# EAGLE design smoothie ramps (EAGLE 6.2)
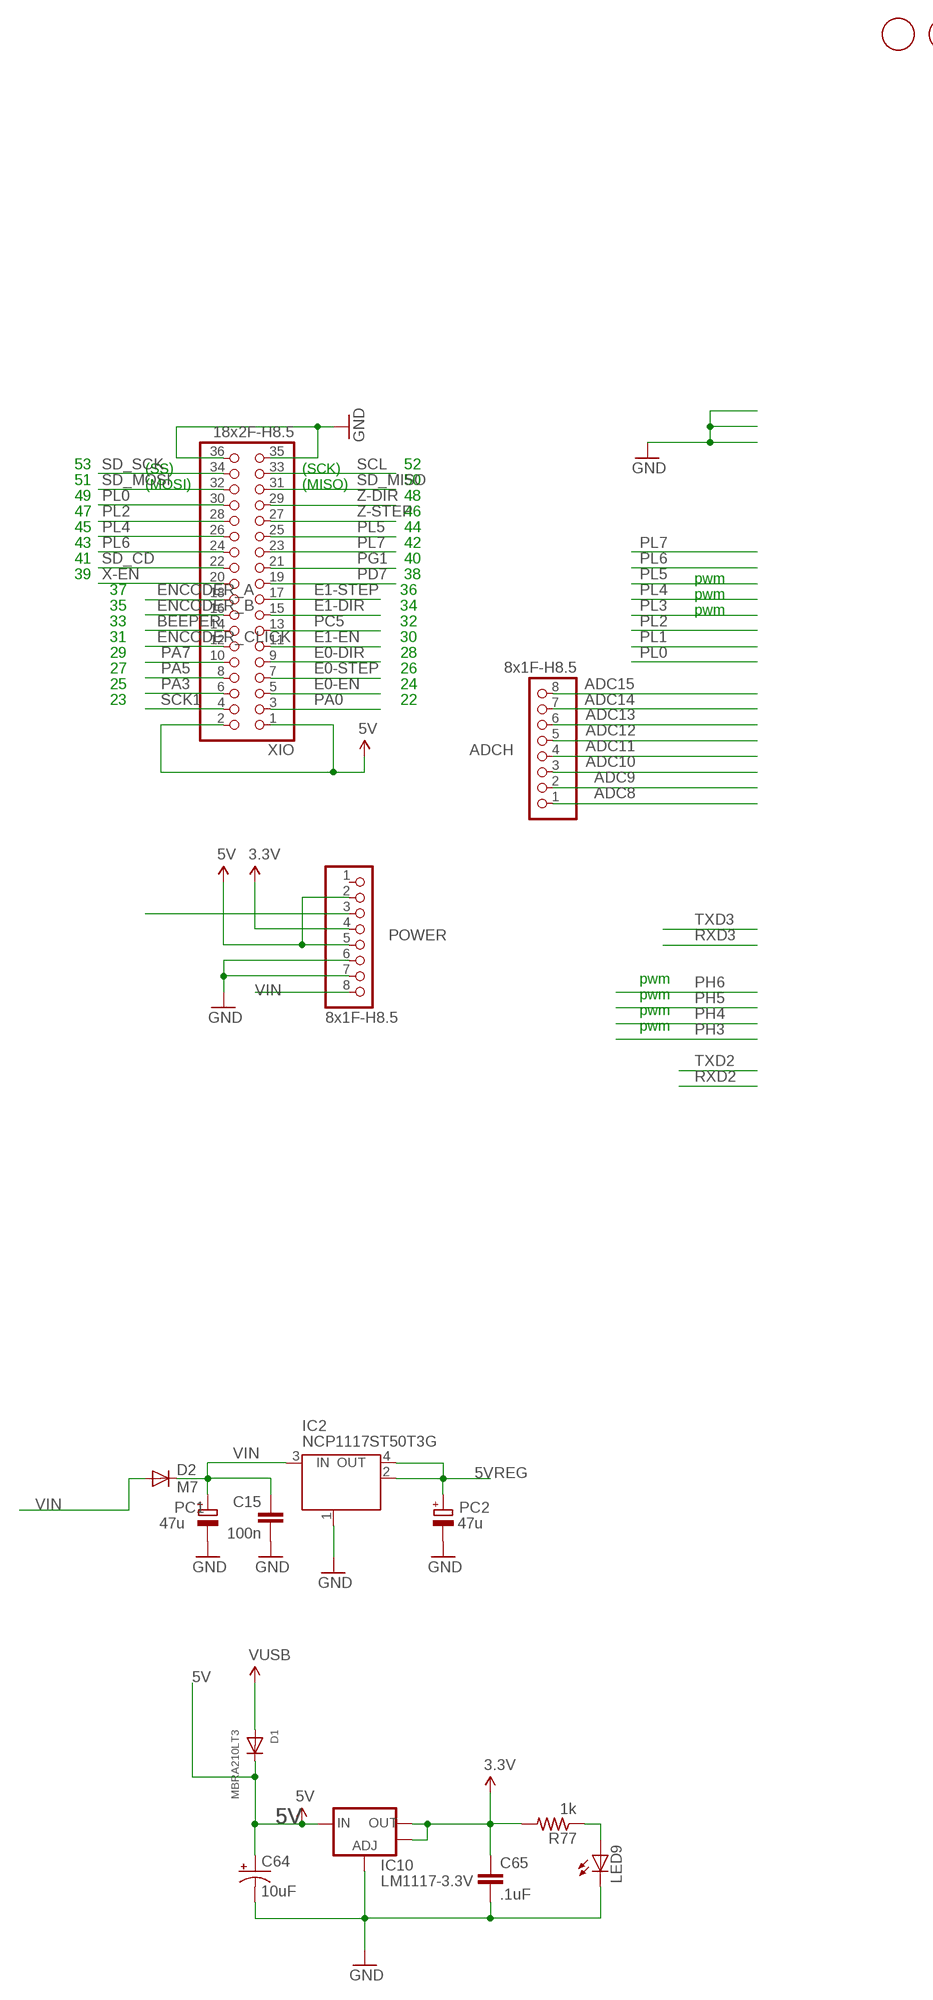
[diagram p0: schematic, sheet 1, part 1 of 2]
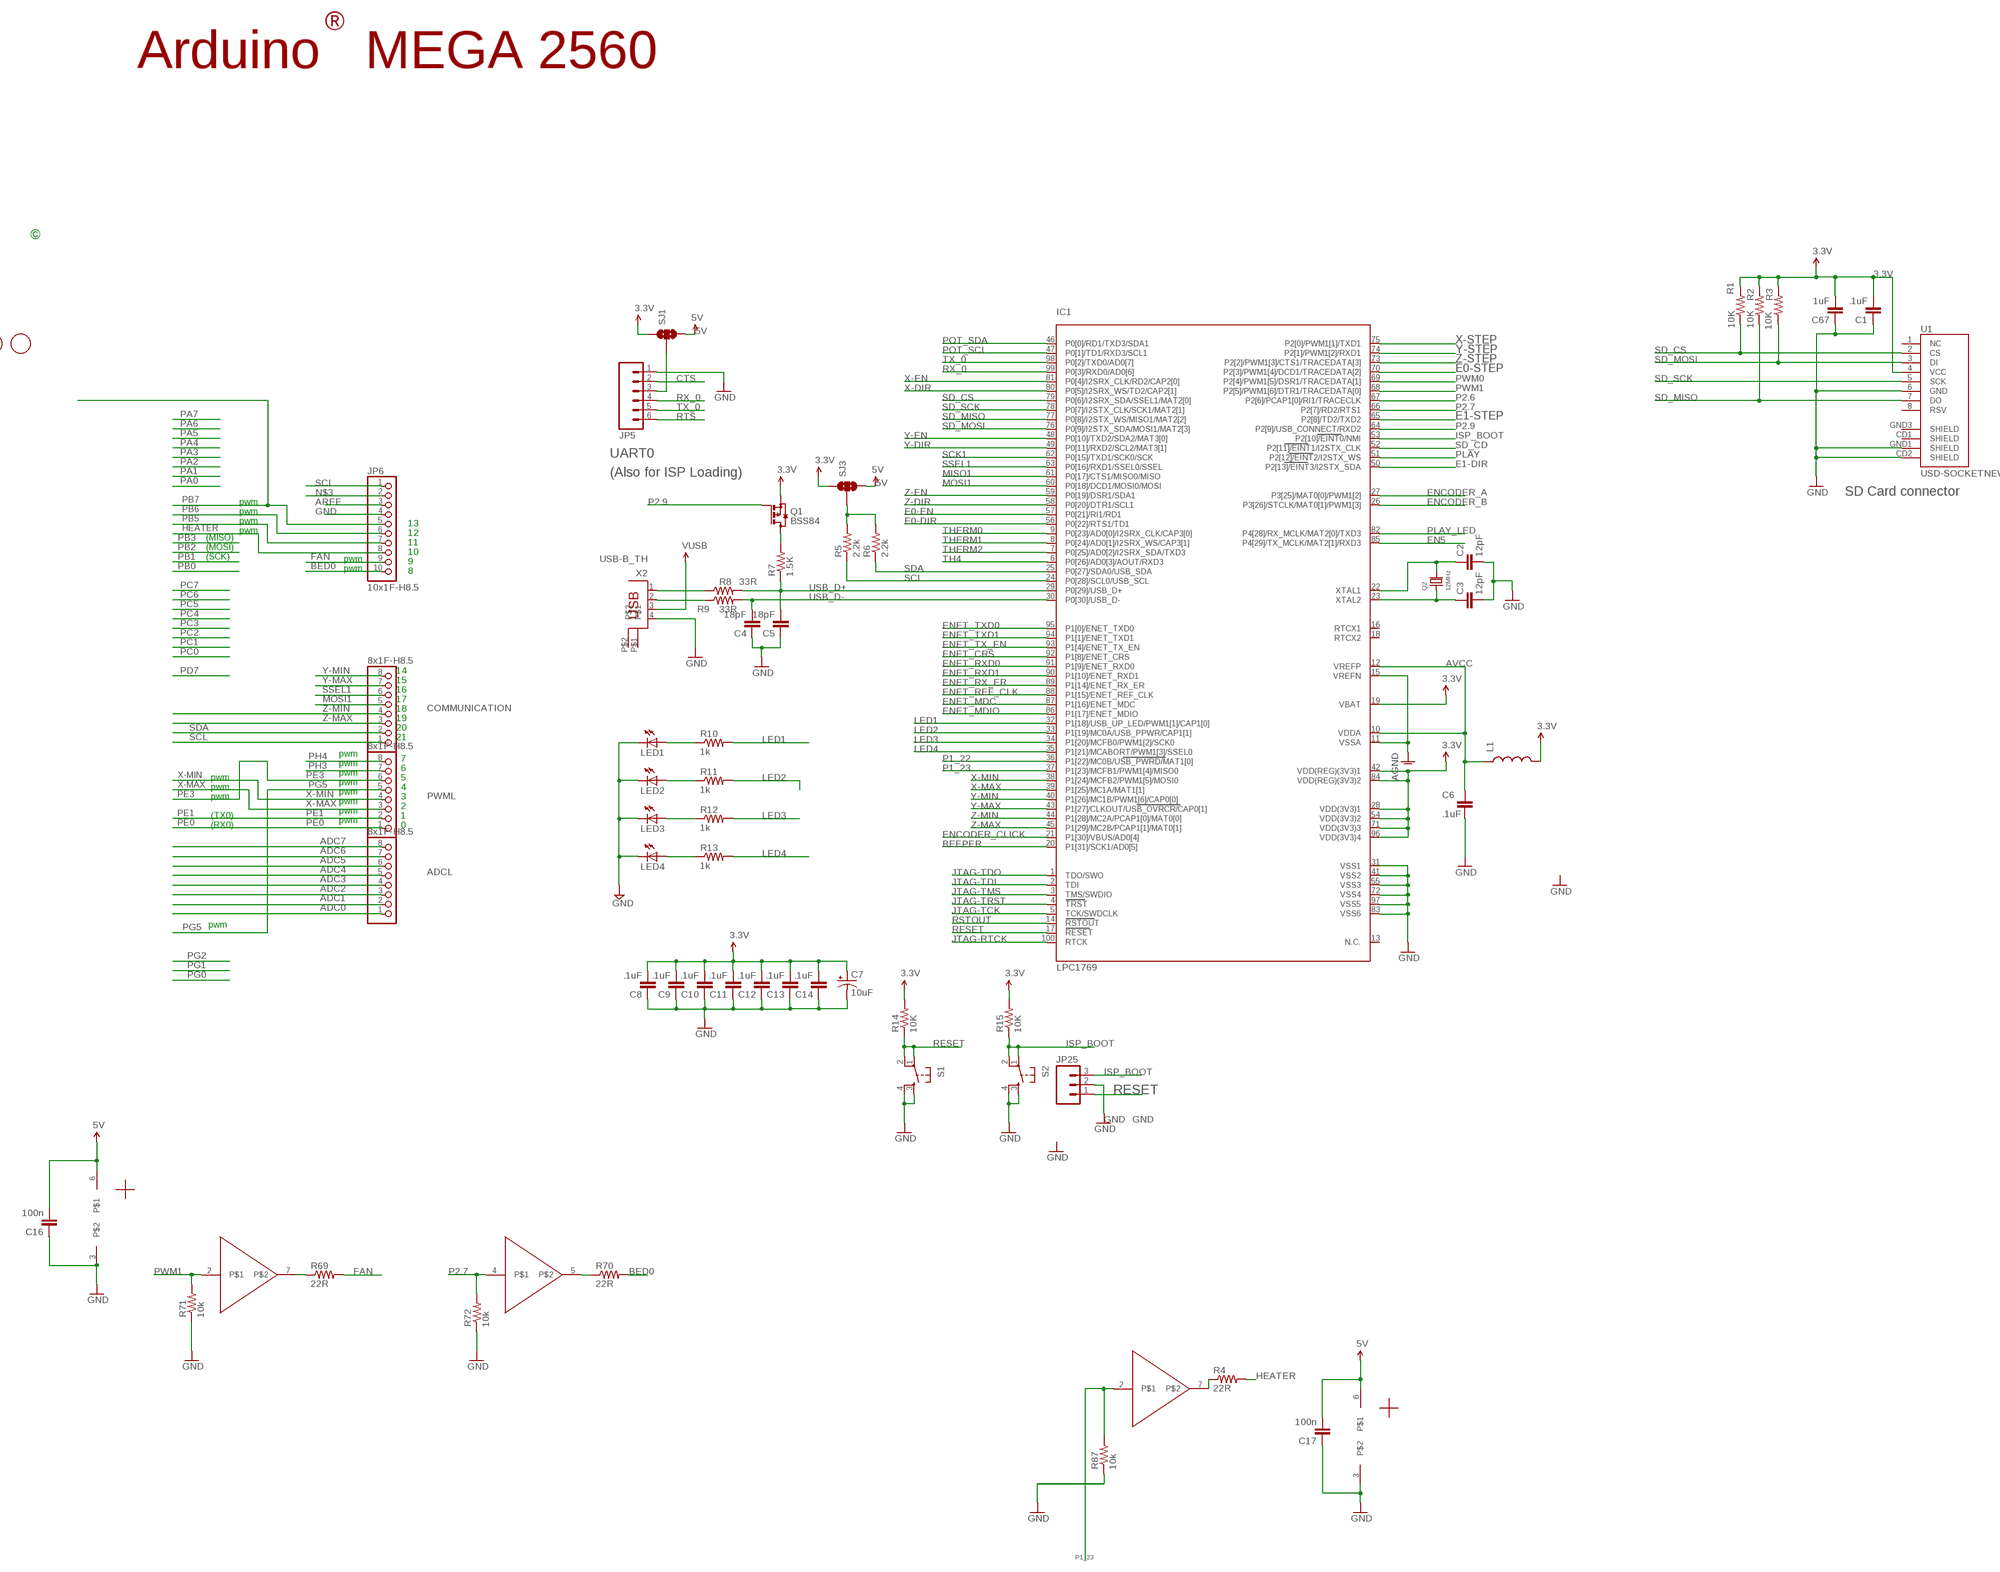
[diagram p1: schematic, sheet 1, part 2 of 2]

## Parts
ADCH  8x1F-H8.5  PINHD-1X8  [1X08]
ADCL  8x1F-H8.5  PINHD-1X8  [1X08]
C1  .1uF  C-EUC0603  [C0603]
C2  12pF  C-EUC0603  [C0603]
C3  12pF  C-EUC0603  [C0603]
C4  18pF  C-EUC0603  [C0603]
C5  18pF  C-EUC0603  [C0603]
C6  .1uF  C-EUC0603  [C0603]
C7  10uF  CAP_POL1206  [EIA3216]
C8  .1uF  C-EUC0603  [C0603]
C9  .1uF  C-EUC0603  [C0603]
C10  .1uF  C-EUC0603  [C0603]
C11  .1uF  C-EUC0603  [C0603]
C12  .1uF  C-EUC0603  [C0603]
C13  .1uF  C-EUC0603  [C0603]
C14  .1uF  C-EUC0603  [C0603]
C15  100n  C-EU0603-RND  [C0603-ROUND]
C16  100n  C-EUC0603  [C0603]
C17  100n  C-EUC0603  [C0603]
C64  10uF  CAP_POL1206  [EIA3216]
C65  .1uF  C-EUC0603  [C0603]
C67  1uF  C-EUC0805  [C0805]
COMMUNICATION  8x1F-H8.5  PINHD-1X8  [1X08]
D1  MBRA210LT3  DIODESMA  [SMADIODE]
D2  M7  DIODE-SMB  [SMB]
FD2  FIDUCIALMOUNT  [FIDUCIA-MOUNT]
FD3  FIDUCIALMOUNT  [FIDUCIA-MOUNT]
IC1  LPC1769  LPC1768  [LQFP100]
IC2  NCP1117ST50T3G  MC33269ST-3.3T3  [SOT223]
IC10  LM1117-3.3V  V_REG_LM1117SOT223  [SOT223]
IC14  TC4427  [SOIC8]
IC15  TC4427  [SOIC8]
JP5  M06POLAR  [MOLEX-1X6]
JP6  10x1F-H8.5  PINHD-1X10_ARD  [1X10]
JP25  M03PTH  [1X03]
L1  INDUCTOR0603  [0603]
LED1  LEDCHIP-LED0805  [CHIP-LED0805]
LED2  LEDCHIP-LED0805  [CHIP-LED0805]
LED3  LEDCHIP-LED0805  [CHIP-LED0805]
LED4  LEDCHIP-LED0805  [CHIP-LED0805]
LED9  LEDCHIP-LED0805  [CHIP-LED0805]
PC1  47u  CPOL-EUD  [PANASONIC_D]
PC2  47u  CPOL-EUD  [PANASONIC_D]
POWER  8x1F-H8.5  PINHD-1X8  [1X08]
PWML  8x1F-H8.5  PINHD-1X8  [1X08]
Q1  BSS84  [SOT23]
Q2  12MHz  CRYSTALTHIN  [CRYSTAL_3.2X2.5]
R1  10K  R-US_R0603  [R0603]
R2  10K  R-US_R0603  [R0603]
R3  10K  R-US_R0603  [R0603]
R4  22R  R-US_R0603  [R0603]
R5  2.2k  R-US_R0603  [R0603]
R6  2.2k  R-US_R0603  [R0603]
R7  1.5K  R-US_R0603  [R0603]
R8  33R  R-US_R0603  [R0603]
R9  33R  R-US_R0603  [R0603]
R10  1k  R-US_R0603  [R0603]
R11  1k  R-US_R0603  [R0603]
R12  1k  R-US_R0603  [R0603]
R13  1k  R-US_R0603  [R0603]
R14  10K  R-US_R0603  [R0603]
R15  10K  R-US_R0603  [R0603]
R69  22R  R-US_R0603  [R0603]
R70  22R  R-US_R0603  [R0603]
R71  10k  R-US_R0603  [R0603]
R72  10k  R-US_R0603  [R0603]
R77  1k  R-US_R0603  [R0603]
R87  10k  R-US_R0603  [R0603]
S1  TAC_SWITCHSMD  [TACTILE_SWITCH_SMD]
S2  TAC_SWITCHSMD  [TACTILE_SWITCH_SMD]
SJ1  SOLDERJUMPER_2WAYS  [SJ_3]
SJ3  SOLDERJUMPER_2WAYS  [SJ_3]
U1  USD-SOCKETNEW  [MICRO-SD-SOCKET-PP]
X2  USB-B_TH  PN61729  [PN61729]
XIO  18x2F-H8.5  PINHD-2X18  [2X18]

## Nets
3.3V: C1.2 C7.A(+) C8.2 C9.2 C10.2 C11.2 C12.2 C13.2 C14.2 C65.1 C67.2 IC1.19(VBAT) IC1.28(VDD(3V3)1) IC1.42(VDD(REG)(3V3)1) IC1.54(VDD(3V3)2) IC1.71(VDD(3V3)3) IC1.84(VDD(REG)(3V3)2) IC1.96(VDD(3V3)4) IC10.2(OUT) IC10.4(OUT) L1.2 POWER.4 Q1.2(S) R1.2 R2.2 R3.2 R14.2 R15.2 R77.2 SJ1.1 SJ3.1 U1.4(VCC)
5V: C16.2 C17.2 C64.A(+) D1.C IC10.3(IN) IC14.6 IC15.6 POWER.2 POWER.5 SJ1.3 SJ3.3 XIO.1 XIO.2
5VREG: IC2.2(OUT) IC2.4(OUT) PC2.+
ADC0: ADCL.1
ADC1: ADCL.2
ADC2: ADCL.3
ADC3: ADCL.4
ADC4: ADCL.5
ADC5: ADCL.6
ADC6: ADCL.7
ADC7: ADCL.8
ADC8: ADCH.1
ADC9: ADCH.2
ADC10: ADCH.3
ADC11: ADCH.4
ADC12: ADCH.5
ADC13: ADCH.6
ADC14: ADCH.7
ADC15: ADCH.8
AGND: IC1.11(VSSA) IC1.15(VREFN)
AREF: JP6.3
AVCC: C6.1 IC1.10(VDDA) IC1.12(VREFP) L1.1
BED0: JP6.10 R70.2
BEEPER: IC1.20(P1[31]/SCK1/AD0[5]) XIO.14
CTS: JP5.2
E0-DIR: IC1.56(P0[22]/RTS1/TD1) XIO.9
E0-EN: IC1.57(P0[21]/RI1/RD1) XIO.5
E0-STEP: IC1.70(P2[3]/PWM1[4]/DCD1/TRACEDATA[2]) XIO.7
E1-DIR: IC1.50(P2[13]/EINT3/I2STX_SDA) XIO.15
E1-EN: XIO.11
E1-STEP: IC1.65(P2[8]/TD2/TXD2) XIO.17
EN5: IC1.85(P4[29]/TX_MCLK/MAT2[1]/RXD3)
ENCODER_A: IC1.27(P3[25]/MAT0[0]/PWM1[2]) XIO.18
ENCODER_B: IC1.26(P3[26]/STCLK/MAT0[1]/PWM1[3]) XIO.16
ENCODER_CLICK: IC1.21(P1[30]/VBUS/AD0[4]) XIO.12
ENET_CRS: IC1.92(P1[8]/ENET_CRS)
ENET_MDC: IC1.87(P1[16]/ENET_MDC)
ENET_MDIO: IC1.86(P1[17]/ENET_MDIO)
ENET_REF_CLK: IC1.88(P1[15]/ENET_REF_CLK)
ENET_RX_ER: IC1.89(P1[14]/ENET_RX_ER)
ENET_RXD0: IC1.91(P1[9]/ENET_RXD0)
ENET_RXD1: IC1.90(P1[10]/ENET_RXD1)
ENET_TX_EN: IC1.93(P1[4]/ENET_TX_EN)
ENET_TXD0: IC1.95(P1[0]/ENET_TXD0)
ENET_TXD1: IC1.94(P1[1]/ENET_TXD1)
FAN: JP6.9 R69.2
GND [gnd]: C1.1 C2.2 C3.2 C4.1 C5.1 C6.2 C7.C(-) C8.1 C9.1 C10.1 C11.1 C12.1 C13.1 C14.1 C15.2 C16.1 C17.1 C64.C(-) C65.2 C67.1 IC1.31(VSS1) IC1.41(VSS2) IC1.55(VSS3) IC1.72(VSS4) IC1.83(VSS6) IC1.97(VSS5) IC2.1(GND/ADJ) IC10.1(ADJ) IC14.3 IC15.3 JP5.1 JP6.4 JP25.2 LED1.C LED2.C LED3.C LED4.C LED9.C PC1.- PC2.- POWER.6 POWER.7 R71.1 R72.1 R87.1 S1.3 S1.4 S2.3 S2.4 U1.6(GND) U1.CD2(SHIELD) U1.GND1(SHIELD) X2.4 XIO.35 XIO.36
HEATER: JP6.8 R4.2
ISP_BOOT: IC1.53(P2[10]/EINT0/NMI) JP25.3 R15.1 S2.1 S2.2
JTAG-RTCK: IC1.100(RTCK)
JTAG-TCK: IC1.5(TCK/SWDCLK)
JTAG-TDI: IC1.2(TDI)
JTAG-TDO: IC1.1(TDO/SWO)
JTAG-TMS: IC1.3(TMS/SWDIO)
JTAG-TRST: IC1.4(TRST)
LED1: IC1.32(P1[18]/USB_UP_LED/PWM1[1]/CAP1[0]) R10.2
LED2: IC1.33(P1[19]/MC0A/USB_PPWR/CAP1[1]) R11.2
LED3: IC1.34(P1[20]/MCFB0/PWM1[2]/SCK0) R12.2
LED4: IC1.35(P1[21]/MCABORT/PWM1[3]/SSEL0) R13.2
MISO1: IC1.61(P0[17]/CTS1/MISO0/MISO)
MOSI1: COMMUNICATION.5 IC1.60(P0[18]/DCD1/MOSI0/MOSI)
N$1: C2.1 IC1.22(XTAL1) Q2.2
N$2: C3.1 IC1.23(XTAL2) Q2.1
N$3: JP6.2
N$4: IC15.7 R4.1
N$5: IC14.7 R69.1
N$19: IC14.5 R70.1
N$23: JP5.3 SJ1.2
N$51: Q1.3(D) R7.2
N$61: R8.1 X2.1
N$62: R9.1 X2.2
N$80: LED9.A R77.1
N$84: LED4.A R13.1
N$85: LED3.A R12.1
N$86: LED2.A R11.1
N$87: LED1.A R10.1
N$124: R5.2 R6.2 SJ3.2
P1_22: IC1.36(P1[22]/MC0B/USB_PWRD/MAT1[0])
P1_23: IC1.37(P1[23]/MCFB1/PWM1[4]/MISO0) IC15.2 R87.2
P2.6: IC1.67(P2[6]/PCAP1[0]/RI1/TRACECLK)
P2.7: IC1.66(P2[7]/RD2/RTS1) IC14.4 R72.2
P2.9: IC1.64(P2[9]/USB_CONNECT/RXD2) Q1.1(G)
PA0: XIO.3
PA3: XIO.6
PA5: XIO.8
PA7: XIO.10
PB5: JP6.7
PB6: JP6.6
PB7: JP6.5
PC5: XIO.13
PD7: XIO.19
PE0: PWML.1
PE1: PWML.2
PE3: PWML.6
PG1: XIO.21
PG5: PWML.5
PH3: PWML.7
PH4: PWML.8
PL0: XIO.30
PL2: XIO.28
PL4: XIO.26
PL5: XIO.25
PL6: XIO.24
PL7: XIO.23
PLAY: IC1.51(P2[12]/EINT2/I2STX_WS)
PLAY_LED: IC1.82(P4[28]/RX_MCLK/MAT2[0]/TXD3)
POT_SCL: IC1.47(P0[1]/TD1/RXD3/SCL1)
POT_SDA: IC1.46(P0[0]/RD1/TXD3/SDA1)
PWM0: IC1.69(P2[4]/PWM1[5]/DSR1/TRACEDATA[1])
PWM1: IC1.68(P2[5]/PWM1[6]/DTR1/TRACEDATA[0]) IC14.2 R71.2
RESET: IC1.17(RESET) JP25.1 POWER.3 R14.1 S1.1 S1.2
RSTOUT: IC1.14(RSTOUT)
RTS: JP5.6
RX_0: IC1.99(P0[3]/RXD0/AD0[6]) JP5.4
SCK1: IC1.62(P0[15]/TXD1/SCK0/SCK) XIO.4
SCL: COMMUNICATION.1 IC1.24(P0[28]/SCL0/USB_SCL) JP6.1 R5.1 XIO.33
SD_CD: IC1.52(P2[11]/EINT1/I2STX_CLK) XIO.22
SD_CS: IC1.79(P0[6]/I2SRX_SDA/SSEL1/MAT2[0]) R1.1 U1.2(CS)
SD_MISO: IC1.77(P0[8]/I2STX_WS/MISO1/MAT2[2]) R2.1 U1.7(DO) XIO.31
SD_MOSI: IC1.76(P0[9]/I2STX_SDA/MOSI1/MAT2[3]) R3.1 U1.3(DI) XIO.32
SD_SCK: IC1.78(P0[7]/I2STX_CLK/SCK1/MAT2[1]) U1.5(SCK) XIO.34
SDA: COMMUNICATION.2 IC1.25(P0[27]/SDA0/USB_SDA) R6.1
SSEL1: COMMUNICATION.6 IC1.63(P0[16]/RXD1/SSEL0/SSEL)
TH4: IC1.6(P0[26]/AD0[3]/AOUT/RXD3)
THERM0: IC1.9(P0[23]/AD0[0]/I2SRX_CLK/CAP3[0])
THERM1: IC1.8(P0[24]/AD0[1]/I2SRX_WS/CAP3[1])
THERM2: IC1.7(P0[25]/AD0[2]/I2SRX_SDA/TXD3)
TX_0: IC1.98(P0[2]/TXD0/AD0[7]) JP5.5
USB_D+: C5.2 IC1.29(P0[29]/USB_D+) R7.1 R8.2
USB_D-: C4.2 IC1.30(P0[30]/USB_D-) R9.2
VIN [power]: C15.1 D2.A D2.C IC2.3(IN) PC1.+ POWER.8
VUSB: D1.A X2.3
X-DIR: IC1.80(P0[5]/I2SRX_WS/TD2/CAP2[1])
X-EN: IC1.81(P0[4]/I2SRX_CLK/RD2/CAP2[0]) XIO.20
X-MAX: IC1.39(P1[25]/MC1A/MAT1[1]) PWML.3
X-MIN: IC1.38(P1[24]/MCFB2/PWM1[5]/MOSI0) PWML.4
X-STEP: IC1.75(P2[0]/PWM1[1]/TXD1)
Y-DIR: IC1.49(P0[11]/RXD2/SCL2/MAT3[1])
Y-EN: IC1.48(P0[10]/TXD2/SDA2/MAT3[0])
Y-MAX: COMMUNICATION.7 IC1.43(P1[27]/CLKOUT/USB_OVRCR/CAP0[1])
Y-MIN: COMMUNICATION.8 IC1.40(P1[26]/MC1B/PWM1[6]/CAP0[0])
Y-STEP: IC1.74(P2[1]/PWM1[2]/RXD1)
Z-DIR: IC1.58(P0[20]/DTR1/SCL1) XIO.29
Z-EN: IC1.59(P0[19]/DSR1/SDA1)
Z-MAX: COMMUNICATION.3 IC1.45(P1[29]/MC2B/PCAP1[1]/MAT0[1])
Z-MIN: COMMUNICATION.4 IC1.44(P1[28]/MC2A/PCAP1[0]/MAT0[0])
Z-STEP: IC1.73(P2[2]/PWM1[3]/CTS1/TRACEDATA[3]) XIO.27
Unconnected: IC1.13(N.C.) IC1.16(RTCX1) IC1.18(RTCX2) IC15.4 IC15.5 POWER.1 U1.1(NC) U1.8(RSV) U1.CD1(SHIELD) U1.GND3(SHIELD) X2.P$1 X2.P$2

## Notes on the sheet
- ®
- Arduino   MEGA 2560
- ©
- UART0
- (Also for ISP Loading)
- SD Card connector
- pwm
- pwm
- pwm | 13
- pwm | 12
- (MISO)
- 11
- (MOSI)
- 10
- (SCK) | pwm
- 9
- pwm | 8
- 53 | (SS) | (SCK) | 52
- 51 | (MOSI) | (MISO) | 50
- 49 | 48
- 47 | 46
- 45 | 44
- 43 | 42
- 41 | 40
- 39 | 38 | pwm | 14
- 37 | 36 | pwm | 15
- 35 | 34 | pwm | 16
- 33 | 32 | 17
- 31 | 30 | 18
- 29 | 28 | 19
- 27 | 26 | 20
- 25 | 24 | 21
- 23 | 22
- pwm
- 7
- pwm
- 6
- pwm
- pwm | 5
- pwm
- pwm | 4
- pwm
- pwm | 3
- pwm
- 2
- pwm
- (TX0) | 1
- pwm
- (RX0) | 0
- pwm
- pwm | pwm
- pwm
- pwm
- MEGA Conn.

## Library data of the parts
ADCH ADCL COMMUNICATION POWER PWML = SmartPrj:PINHD-1X8: PIN HEADER
C1 C65 C67 = resistor:C-EU: CAPACITOR, European symbol
C2-C6 C8-C14 C16 C17 = rcl:C-EU: CAPACITOR, European symbol
C7 C64 = SparkFun:CAP_POL: Capacitor Polarized These are standard SMD and PTH capacitors. Normally 10uF, 47uF, and 100uF in electrolytic and tantalum varieties. Always verify the external diameter of the through hole cap, it varies with capacity, voltage, and manufacturer. The EIA devices should be standard.
C15 = SmartPrj:C-EU: CAPACITOR, European symbol
D1 = microbuilder:DIODE: Diode SMADIODE - SMA Surface Mount Package 20V 1A Schottky Diode Digikey (500mV @ 1A, 500uA Vr @ 20V): 641-1014-6-ND 10V 2A Schottky Diode Digikey (350mV @ 2A, 700uA Vr @ 10V): MBRA210LT3 SOD-123 30V 200mA (800mV Vf, 2uA Vr @ 25V) Schottky Diode (very fast switching for boost, etc.) - Digikey: BAT54T1GOSTR-ND 30V 500mA (430mV Vf, 130uA Vr @ 30V) Schottky Diode - Digikey: B0530W-FDICT-ND MBR120 1A 20V (0.34Vf) Schottky Diode - Digikey: MBR120VLSFT1GOSCT-ND SOD-323 10V 570mA (380mV Vf, 3ns) Schottky Diode - Digikey: ZLLS410CT-ND 1N4148WS - 75V 150mA (1V Vf @ 10mA, 4ns) Simple Diode - Digikey: 1N4148WSFSCT-ND, Mouser: 512-1N4148WS SOD-523 BAT54 30V 200mA Schottky (0.8 Vf @ 100mA, 5ns) - Digikey: BAT54XV2CT-ND 30V 30mA Schottky Diode (RB751S-40TE61) - Digikey: RB751S-40TE61CT-ND SOT23-R/W - SOT23 Package (R = Solder Paste/Reflow Ovens, W = Hand-Soldering) BAT54Film 40V 300mA - Digikey: 497-7162-1-ND DO-1N4148 Through Hole Small Current Diode (any model)
D2 = diode:DIODE-: DIODE
FD2 FD3 = SmartPrj:FIDUCIALMOUNT
IC1 = microbuilder:LPC1768: LPC1768 100 MHz 32-bit ARM Cortex-M3 based microcontroller featuring a high level of integration and low power consumption. 512 kB Flash, 64 kB SRAM, USB Device/Host/OTG, Ethernet, CAN, I2S, 10-bit DAC Digikey: 568-4796-ND
IC2 = linear:MC33269ST*: Adjustable Output Low Dropout Voltage Regulator 800 mA Source: http://www.onsemi.com/pub/Collateral/MC33269-D.PDF
IC10 = SparkFun:V_REG_LM1117: Voltage Regulator LM1117 Standard adjustable voltage regulator but in SMD form. Spark Fun Electronics SKU : COM-00595
IC14 IC15 = custom_esorensen:TC4427
JP5 = SparkFun:M06: Header 6 Standard 6-pin 0.1" header. Use with straight break away headers (SKU : PRT-00116), right angle break away headers (PRT-00553), swiss pins (PRT-00743), machine pins (PRT-00117), and female headers (PRT-00115). Molex polarized connector foot print use with SKU : PRT-08094 with associated crimp pins and housings. NOTES ON THE VARIANTS LOCK and LOCK_LONGPADS... This footprint was designed to help hold the alignment of a through-hole component (i.e. 6-pin header) while soldering it into place. You may notice that each hole has been shifted either up or down by 0.005 of an inch from it's more standard position (which is a perfectly straight line). This slight alteration caused the pins (the squares in the middle) to touch the edges of the holes. Because they are alternating, it causes a "brace" to hold the component in place. 0.005 has proven to be the perfect amount of "off-center" position when using our standard breakaway headers. Although looks a little odd when you look at the bare footprint, once you have a header in there, the alteration is very hard to notice. Also, if you push a header all the way into place, it is covered up entirely on the bottom side. This idea of altering the position of holes to aid alignment will be further integrated into the Sparkfun Library for other footprints. It can help hold any component with 3 or more connection pins.
JP6 = SmartPrj:PINHD-1X10_ARD: PIN HEADER
JP25 = SparkFun-Connectors:M03: Header 3 Standard 3-pin 0.1" header. Use with straight break away headers (SKU : PRT-00116), right angle break away headers (PRT-00553), swiss pins (PRT-00743), machine pins (PRT-00117), and female headers (PRT-00115). Molex polarized connector foot print use with SKU : PRT-08232 with associated crimp pins and housings.
L1 = SparkFun:INDUCTOR: Inductors Basic Inductor/Choke - 0603 and 1206. Footprints are not proven and vary greatly between part numbers.
LED1-LED4 LED9 = led:LED: LED OSRAM: - CHIPLED LG R971, LG N971, LY N971, LG Q971, LY Q971, LO R971, LY R971 LH N974, LH R974 LS Q976, LO Q976, LY Q976 LO Q996 - Hyper CHIPLED LW Q18S LB Q993, LB Q99A, LB R99A - SideLED LS A670, LO A670, LY A670, LG A670, LP A670 LB A673, LV A673, LT A673, LW A673 LH A674 LY A675 LS A676, LA A676, LO A676, LY A676, LW A676 LS A679, LY A679, LG A679 - Hyper Micro SIDELED® LS Y876, LA Y876, LO Y876, LY Y876 LT Y87S - SmartLED LW L88C, LW L88S LB L89C, LB L89S, LG L890 LS L89K, LO L89K, LY L89K LS L896, LA L896, LO L896, LY L896 - TOPLED LS T670, LO T670, LY T670, LG T670, LP T670 LSG T670, LSP T670, LSY T670, LOP T670, LYG T670 LG T671, LOG T671, LSG T671 LB T673, LV T673, LT T673, LW T673 LH T674 LS T676, LA T676, LO T676, LY T676, LB T676, LH T676, LSB T676, LW T676 LB T67C, LV T67C, LT T67C, LS T67K, LO T67K, LY T67K, LW E67C LS E67B, LA E67B, LO E67B, LY E67B, LB E67C, LV E67C, LT E67C LW T67C LS T679, LY T679, LG T679 LS T770, LO T770, LY T770, LG T770, LP T770 LB T773, LV T773, LT T773, LW T773 LH T774 LS E675, LA E675, LY E675, LS T675 LS T776, LA T776, LO T776, LY T776, LB T776 LHGB T686 LT T68C, LB T68C - Hyper Mini TOPLED® LB M676 - Mini TOPLED Santana® LG M470 LS M47K, LO M47K, LY M47K Source: http://www.osram.convergy.de LUXEON: - LUMILED® LXK2-PW12-R00, LXK2-PW12-S00, LXK2-PW14-U00, LXK2-PW14-V00 LXK2-PM12-R00, LXK2-PM12-S00, LXK2-PM14-U00 LXK2-PE12-Q00, LXK2-PE12-R00, LXK2-PE12-S00, LXK2-PE14-T00, LXK2-PE14-U00 LXK2-PB12-K00, LXK2-PB12-L00, LXK2-PB12-M00, LXK2-PB14-N00, LXK2-PB14-P00, LXK2-PB14-Q00 LXK2-PR12-L00, LXK2-PR12-M00, LXK2-PR14-Q00, LXK2-PR14-R00 LXK2-PD12-Q00, LXK2-PD12-R00, LXK2-PD12-S00 LXK2-PH12-R00, LXK2-PH12-S00 LXK2-PL12-P00, LXK2-PL12-Q00, LXK2-PL12-R00 Source: www.luxeon.com KINGBRIGHT: KA-3528ASYC Source: www.kingbright.com
PC1 PC2 = rcl:CPOL-EU: POLARIZED CAPACITOR, European symbol
Q1 = transistor-small-signal:BSS84: P-CHANNEL MOS FET
Q2 = microbuilder:CRYSTAL: Crystals HC49UP - Surface Mount Crystal 4.0MHz 18pF +/-30ppm Surface Mount Crystal [Digikey: 535-9857-1-ND] 12.0 MHz Surface Mount Crystal [Digikey: 535-9869-6-ND] 25.0 MHz Surface Mount Crystal [Digikey: 535-9078-1-ND] 3.2 x 2.5mm - MEMs SMT Crystal 12.0 MHz 8pF 15ppm 3.2 x 2.5mm Crystal [Digikey: -10-70°C: 644-1047-1-ND -40-125°C: 644-1128-1-ND] 16.0 MHz 8pF 15ppm 3.2 x 2.5mm Crystal [Digikey: -10-70°C: 644-1049-1-ND -40-125°C: 644-1129-2-ND] 16.0 MHz 10pF 10ppm 3.2 x 2.5mm Crystal [Digikey: 644-1100-1-ND] 27.12 MHz 18pF 30ppm 3.2 x 2.5mm Crystal [Digikey: 887-1424-1-ND] 27.12MHz 10pF 10ppm 3.2 x 2.5mm Crystal [Digikey: 887-1329-1-ND] 4.9 x 1.8mm - MEMs SMT Crystal 32.768 KHz 12.5pF 20ppm 4.9 x 1.8mm Crystal [Digikey: SE2415CT-ND] Cylinder 32.768KHz Cylinder Crystal
R1-R15 R69-R72 R77 R87 = resistor:R-US_: RESISTOR, American symbol
S1 S2 = SparkFun:TAC_SWITCH: Momentary Switch Button commonly used for reset or general input. Spark Fun Electronics SKU : COM-00097
SJ1 SJ3 = SparkFun:SOLDERJUMPER_2WAY: Solder Jumper 2 way solder jumper
U1 = SparkFun:USD-SOCKET: microSD Socket Push-push type uSD socket. Schematic element and footprint production proven. Spark Fun Electronics SKU : PRT-00127. tDoc lines correctly indicate media card edge positions when inserting (unlocked, locked, depressed).
X2 = SmartPrj:PN61729: BERG USB connector
XIO = SmartPrj:PINHD-2X18: PIN HEADER

## Net classes
1 power: width 0.61 mm, drill 0.406 mm, clearance 0.203 mm
2 gnd: width 0.305 mm, drill 0.406 mm, clearance 0.203 mm
3 power usb: width 0.508 mm, drill 0.406 mm, clearance 0.203 mm

## Board
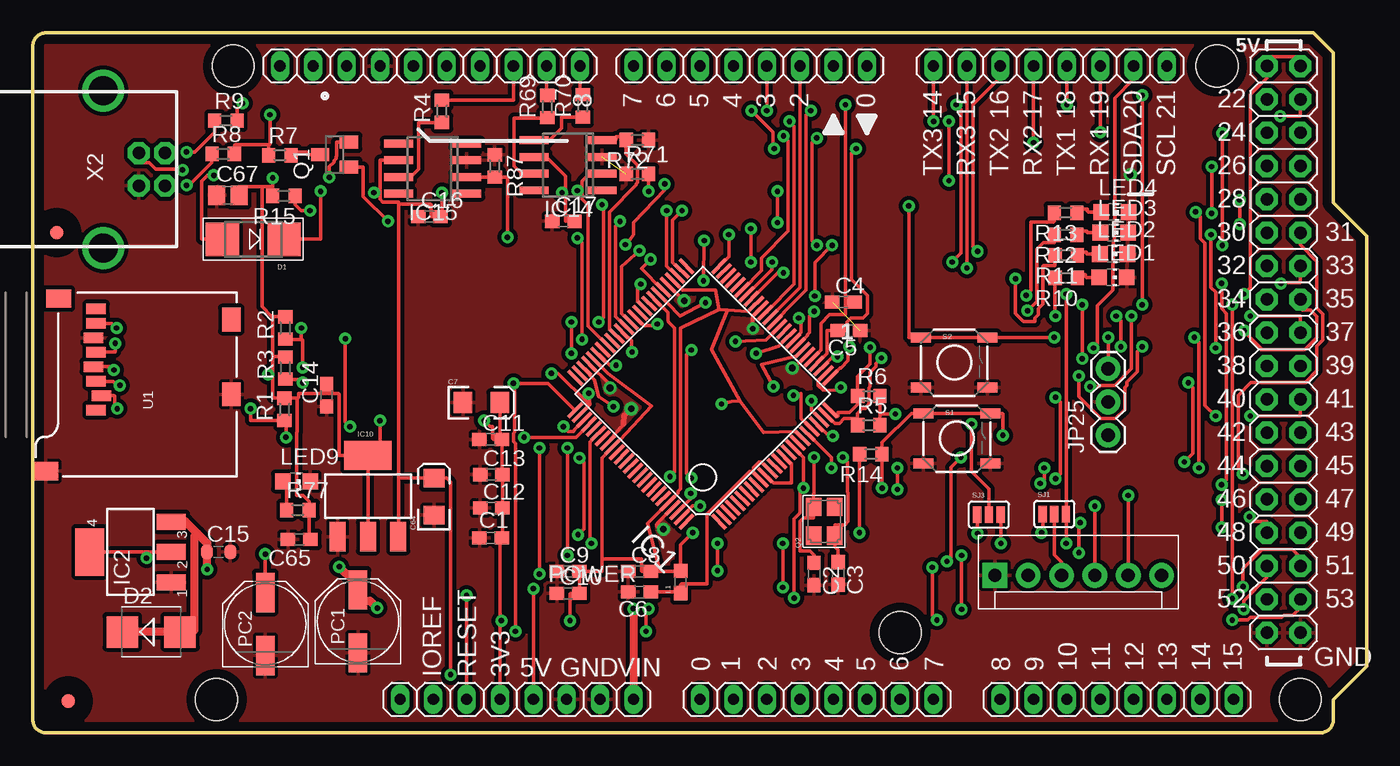
[diagram p2: board, top side]
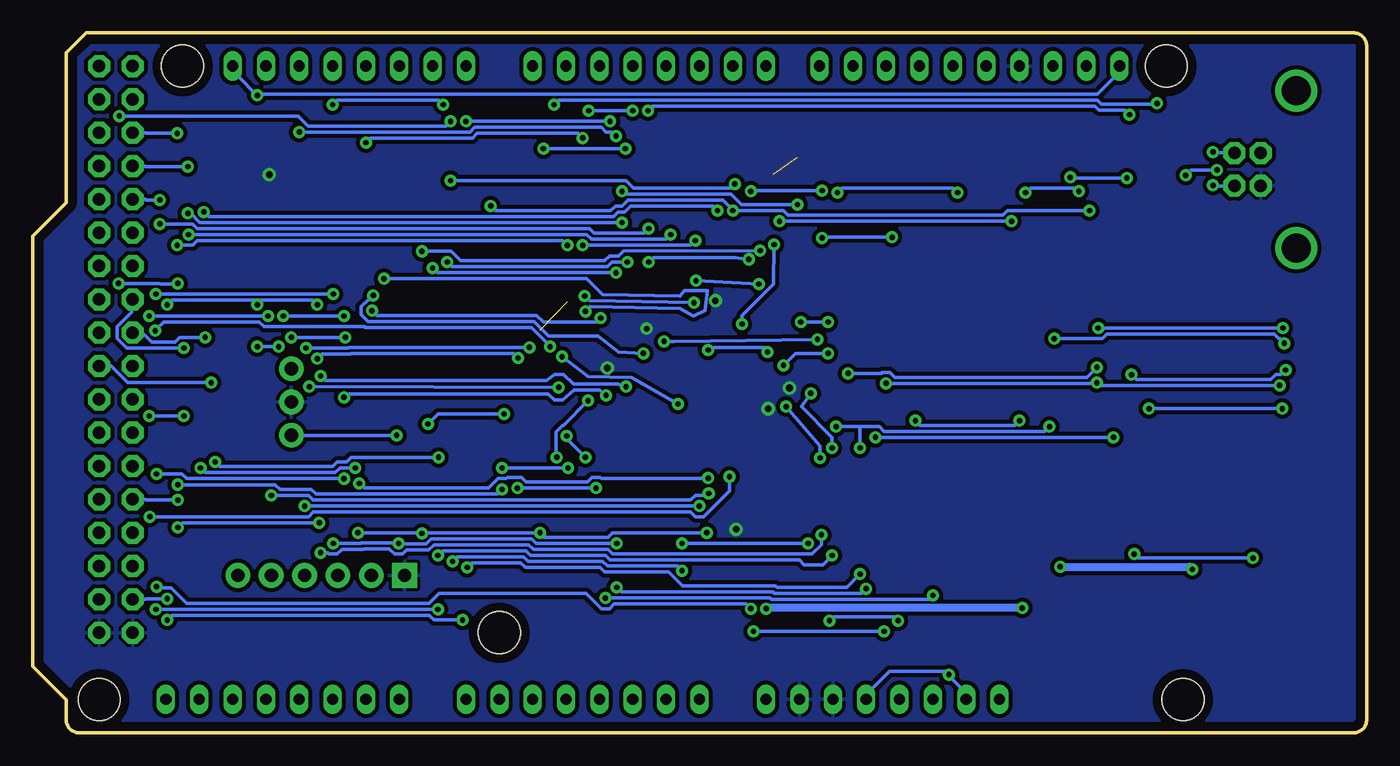
[diagram p3: board, bottom side, seen from below]

Size 101.6 x 53.34 mm. Coordinates in mm from the lower left corner, seen from the top.
Outline: 97.54,53.34 99.06,51.82 99.06,40.39 101.6,37.85 101.6,5.08 99.06,2.54 99.06,1 arc-90 98.06,0 1,0 arc-90 0,1 0,52.34 arc-90 1,53.34 97.54,53.34
Copper layers (1*16): Top 0.035mm / dielectric 1.5mm / Bottom 0.035mm
Design rules: minimum track width 10mil, minimum drill 16mil, track to track 7mil, track to pad 7mil, pad to pad 8mil, via to via 10mil, smd to smd 7mil, copper to edge 27mil, drill to drill 12mil, minimum pad ring 10mil, minimum via ring 10mil, stop-mask expansion 2mil, vias tented up to drill 24mil, thermal gap 10mil
Holes 3.2 mm at 96.55,2.55 15.27,50.81 90.2,50.81 14,2.55 66.07,7.63

### Footprints (pad centres in the part's own frame; a part is rotated, then mirrored left to right if it is on the bottom)
1X08 = drill 0.85 pad 1.422 long: 1 -8.89,0; 2 -6.35,0; 3 -3.81,0; 4 -1.27,0; 5 1.27,0; 6 3.81,0; 7 6.35,0; 8 8.89,0
C0603 = smd 1.1 x 1: 1 -0.85,0; 2 0.85,0
EIA3216 = smd 1.4 x 1.6: A 1.4,0; C -1.4,0
C0603-ROUND = smd 0.898 x 1.1: 1 -0.889,0; 2 0.889,0
C0805 = smd 1.3 x 1.5: 1 -0.85,0; 2 0.85,0
SMADIODE = smd 2.54 x 2.54: A 2.349,0; C -2.349,0
SMB = smd 2.4 x 2.4: A 2.2,0; C -2.2,0
FIDUCIA-MOUNT = smd 1.016 x 1.016: P$1 0,0
LQFP100 = smd 0.27 x 1.5: 1 -6,-7.75; 2 -5.5,-7.75; 3 -5,-7.75; 4 -4.5,-7.75; 5 -4,-7.75; 6 -3.5,-7.75; 7 -3,-7.75; 8 -2.5,-7.75; 9 -2,-7.75; 10 -1.5,-7.75; 11 -1,-7.75; 12 -0.5,-7.75; 13 0,-7.75; 14 0.5,-7.75; 15 1,-7.75; 16 1.5,-7.75; 17 2,-7.75; 18 2.5,-7.75; 19 3,-7.75; 20 3.5,-7.75; 21 4,-7.75; 22 4.5,-7.75; 23 5,-7.75; 24 5.5,-7.75; 25 6,-7.75; 51 6,7.75; 52 5.5,7.75; 53 5,7.75; 54 4.5,7.75; 55 4,7.75; 56 3.5,7.75; 57 3,7.75; 58 2.5,7.75; 59 2,7.75; 60 1.5,7.75; 61 1,7.75; 62 0.5,7.75; 63 0,7.75; 64 -0.5,7.75; 65 -1,7.75; 66 -1.5,7.75; 67 -2,7.75; 68 -2.5,7.75; 69 -3,7.75; 70 -3.5,7.75; 71 -4,7.75; 72 -4.5,7.75; 73 -5,7.75; 74 -5.5,7.75; 75 -6,7.75 | smd 1.5 x 0.27: 26 7.75,-6; 27 7.75,-5.5; 28 7.75,-5; 29 7.75,-4.5; 30 7.75,-4; 31 7.75,-3.5; 32 7.75,-3; 33 7.75,-2.5; 34 7.75,-2; 35 7.75,-1.5; 36 7.75,-1; 37 7.75,-0.5; 38 7.75,0; 39 7.75,0.5; 40 7.75,1; 41 7.75,1.5; 42 7.75,2; 43 7.75,2.5; 44 7.75,3; 45 7.75,3.5; 46 7.75,4; 47 7.75,4.5; 48 7.75,5; 49 7.75,5.5; 50 7.75,6; 76 -7.75,6; 77 -7.75,5.5; 78 -7.75,5; 79 -7.75,4.5; 80 -7.75,4; 81 -7.75,3.5; 82 -7.75,3; 83 -7.75,2.5; 84 -7.75,2; 85 -7.75,1.5; 86 -7.75,1; 87 -7.75,0.5; 88 -7.75,0; 89 -7.75,-0.5; 90 -7.75,-1; 91 -7.75,-1.5; 92 -7.75,-2; 93 -7.75,-2.5; 94 -7.75,-3; 95 -7.75,-3.5; 96 -7.75,-4; 97 -7.75,-4.5; 98 -7.75,-5; 99 -7.75,-5.5; 100 -7.75,-6
SOT223 = smd 1.219 x 2.235: 1 -2.311,-3.099; 2 0,-3.099; 3 2.311,-3.099 | smd 3.6 x 2.2: 4 0,3.099
SOIC8 = smd 0.6 x 2.2: 1 -1.905,-2.6; 2 -0.635,-2.6; 3 0.635,-2.6; 4 1.905,-2.6; 5 1.905,2.6; 6 0.635,2.6; 7 -0.635,2.6; 8 -1.905,2.6
MOLEX-1X6 = drill 1.016 pad 1.88 square: 1 0,0 | drill 1.016 pad 1.88: 2 2.54,0; 3 5.08,0; 4 7.62,0; 5 10.16,0; 6 12.7,0
1X10 = drill 0.85 pad 1.422 long: 1 -11.43,0; 2 -8.89,0; 3 -6.35,0; 4 -3.81,0; 5 -1.27,0; 6 1.27,0; 7 3.81,0; 8 6.35,0; 9 8.89,0; 10 11.43,0
1X03 = drill 1.016 pad 1.88: 1 0,0; 2 2.54,0; 3 5.08,0
0603 = smd 1.1 x 1: 1 -0.85,0; 2 0.85,0
CHIP-LED0805 = smd 1.2 x 1.2: A 0,-1.05; C 0,1.05
PANASONIC_D = smd 3 x 1.4: + 2.4,0; - -2.4,0
SOT23 = smd 1 x 1.4: 1 -0.95,-1.1; 2 0.95,-1.1; 3 0,1.1
CRYSTAL_3.2X2.5 = smd 1.4 x 1.2: 1 -1.1,-0.8; 2 1.1,0.8; GND1 -1.1,0.8; GND2 1.1,-0.8
R0603 = smd 1 x 1.1: 1 -0.85,0; 2 0.85,0
TACTILE_SWITCH_SMD = smd 1.524 x 0.762: 1 -2.54,1.905; 2 2.54,1.905; 3 -2.54,-1.905; 4 2.54,-1.905
SJ_3 = smd 0.635 x 1.27: 1 -0.889,0; 2 0,0; 3 0.889,0
MICRO-SD-SOCKET-PP = smd 0.8 x 1.5: 1 -8.94,10.7; 2 -7.84,10.3; 3 -6.74,10.7; 4 -5.64,10.9; 5 -4.54,10.7; 6 -3.44,10.9; 7 -2.34,10.7; 8 -1.24,10.7 | smd 1.8 x 1.4: CD1 -2.05,0.4; CD2 -7.75,0.4 | smd 1.4 x 1.9: GND1 -13.6,14.55; GND3 -0.45,13.55
PN61729 = drill 0.95 pad 1.676 octagon: 1 1.25,4.71; 2 -1.25,4.71; 3 -1.25,2.71; 4 1.25,2.71 | drill 2.2: P$1 -6,0; P$2 6,0
2X18 = drill 0.95 pad 1.676 octagon: 1 -21.59,-1.27; 2 -21.59,1.27; 3 -19.05,-1.27; 4 -19.05,1.27; 5 -16.51,-1.27; 6 -16.51,1.27; 7 -13.97,-1.27; 8 -13.97,1.27; 9 -11.43,-1.27; 10 -11.43,1.27; 11 -8.89,-1.27; 12 -8.89,1.27; 13 -6.35,-1.27; 14 -6.35,1.27; 15 -3.81,-1.27; 16 -3.81,1.27; 17 -1.27,-1.27; 18 -1.27,1.27; 19 1.27,-1.27; 20 1.27,1.27; 21 3.81,-1.27; 22 3.81,1.27; 23 6.35,-1.27; 24 6.35,1.27; 25 8.89,-1.27; 26 8.89,1.27; 27 11.43,-1.27; 28 11.43,1.27; 29 13.97,-1.27; 30 13.97,1.27; 31 16.51,-1.27; 32 16.51,1.27; 33 19.05,-1.27; 34 19.05,1.27; 35 21.59,-1.27; 36 21.59,1.27

### Placement (x,y rotation side)
ADCH  82.58,2.55 0 top
ADCL  59.72,2.55 0 top
C1  34.87,14.85 0 top
C2  59.51,12.1 270 top
C3  61.34,12.15 270 top
C4  61.75,32.83 0 top
C5  62.15,30.65 180 top
C6  46.2,10.73 180 top
C7  34.16,25.16 0 top
C8  46.2,12.31 0 top
C9  40.77,12.31 0 top
C10  40.77,10.63 0 top
C11  34.87,22.36 0 top
C12  34.93,17.13 0 top
C13  34.93,19.67 0 top
C14  22.38,25.72 90 top
C15  14.15,13.78 0 top
C16  30.2,39.33 0 top
C17  40.41,38.98 0 top
C64  30.56,18 90 top
C65  20.29,14.74 180 top
C67  14.86,40.96 0 top
COMMUNICATION  77.5,50.81 180 top
D1  16.79,37.6 180 top
D2  9.02,7.68 0 top
FD2  2.69,2.43 0 top
FD3  1.8,38.11 0 top
IC1  51.03,25.82 45 top
IC2  7.44,13.78 90 top
IC10  25.53,18.05 0 top
IC14  40.77,43.24 90 top
IC15  30.45,42.99 90 top
JP5  73.28,12 0 top
JP6  30.25,50.81 0 top
JP25  81.92,22.67 90 top
L1  49.35,11.49 90 top
LED1  82.27,34.71 270 top
LED2  82.32,36.49 270 top
LED3  82.37,38.11 270 top
LED4  82.42,39.69 270 top
LED9  20.09,19.16 270 top
PC1  24.77,8.5 90 top
PC2  17.7,8.29 90 top
POWER  36.86,2.55 0 top
PWML  54.64,50.81 180 top
Q1  22.99,44.06 90 top
Q2  60.27,16.12 90 top
R1  19.18,24.65 90 top
R2  19.23,30.85 90 top
R3  19.23,27.8 90 top
R4  31.17,47.36 90 top
R5  63.68,23.43 0 top
R6  63.68,25.67 0 top
R7  18.82,44.01 0 top
R8  14.5,44.11 0 top
R9  14.71,46.65 0 top
R10  78.71,34.66 180 top
R11  78.71,36.39 180 top
R12  78.66,37.96 180 top
R13  78.66,39.64 180 top
R14  63.83,21.25 180 top
R15  19.13,40.91 180 top
R69  39.19,47.71 90 top
R70  41.88,47.76 90 top
R71  46.05,42.58 0 top
R72  46.05,45.17 180 top
R77  20.19,16.98 0 top
R87  35.18,43.19 270 top
S1  70.38,22.42 0 top
S2  70.18,28.21 0 top
SJ1  77.8,16.68 0 top
SJ3  72.82,16.62 0 top
U1  15.52,33.54 90 top
X2  5.36,42.94 270 top
XIO  95.28,29.22 270 top

### Tracks (layer width: path | path; a pad name or v marks a point on that pad's centre or on a via)
3.3V  (via drill 0.41)
  Top 0.254: 18.21,41.62 18.26,41.57 18.26,40.91 R15.2 | 17.45,41.62 15.72,41.62 15.72,40.96 C67.2 | 17.45,41.62 18.21,41.62 | v22.58,42.33 22.58,43.14 22.94,43.5 22.94,43.6 23.09,43.75 23.09,43.9 23.14,43.95 23.14,45.02 24.05,45.02 Q1.2 | v18.26,42.28 18.26,41.72 18.21,41.62 | IC10.2 25.53,21.09 25.48,21.15 25.53,21.2 IC10.4 | C65.1 21.06,14.74 R77.2 21.06,17.08 21.06,17.64 20.6,18.1 20.09,18.1 20.09,22.87 20.14,22.92 20.14,25.41 20.19,25.51 | 18.26,27.29 18.26,28.61 18.31,28.66 | 18.26,27.29 18.26,25.51 19.18,25.51 R1.2 19.28,25.51 20.19,25.51 | 18.31,28.66 R3.2 | 18.26,31.71 R2.2 | 18.26,31.71 18.26,28.77 18.31,28.66 | 22.38,25.92 C14.2 | 22.38,25.92 22.33,25.87 20.24,25.87 20.24,25.56 20.19,25.51 | v6.17,27.65 6.17,27.9 4.65,27.9 U1.4 | 18.26,27.29 v17.91,27.29 | IC10.4 25.37,21.15 23.34,21.15 23.34,25.82 23.29,25.87 22.48,25.87 22.38,25.92 | 17.45,41.62 17.45,32.47 18.16,31.76 18.26,31.71 | C11.2 35.59,22.36 35.59,25.16 C7.A | 35.59,8.55 35.59,14.85 C1.2 35.79,14.95 35.79,17.13 C12.2 35.79,17.23 35.79,19.67 C13.2 35.74,19.77 35.74,22.26 C11.2 | 35.59,8.55 POWER.4 | IC1.71 43.51,27.7 43.82,27.39 47.12,24.9 44.73,22.31 44.17,21.75 IC1.84 44.07,21.65 43.36,20.94 43.36,13.27 | 43.36,13.27 43.36,12.31 C9.2 41.63,12.31 41.63,10.63 C10.2 40.97,10.63 40.92,10.58 v40.92,8.55 | v62.97,15.25 R14.2 | v71.96,15.2 71.96,16.62 SJ3.1 | v76.84,15.25 76.94,15.35 76.94,16.67 SJ1.1 | 47.78,12.31 49.35,12.31 L1.2 49.35,14.34 v50.27,15.25 | 47.78,12.31 C8.2 46.41,12.31 46.36,12.36 46.36,13.27 43.36,13.27 | 47.78,12.31 46.81,15.96 48.34,17.49 IC1.96 48.44,17.59 49.15,18.3 49.15,18.4 49.35,18.61 49.35,30.85 52.25,32.27
  Top 0.254: 52.25,32.27 51.99,33.74 49.5,33.74 48.79,34.45 48.74,34.45 IC1.54 | 52.25,32.27 52.91,32.22 | 52.91,32.22 54.48,32.12 54.94,32.58 54.94,32.63 54.99,32.63 55.09,32.73 IC1.42 | 53.85,25.29 51.69,29.22 52.91,32.22 | 53.85,25.29 55.65,22.87 58.04,22.97 58.55,22.47 58.6,22.47 IC1.19 | v61.29,28.66 60.93,28.66 60.07,27.8 IC1.28 | v52.45,25.06 53.21,25.26 53.85,25.29 | v35.69,8.55 35.59,8.55 | v26.44,23.79 26.44,21.15 25.63,21.15 IC10.4 | v34.37,23.79 34.82,23.33 35.03,23.33 35.03,22.42 35.08,22.36 C11.2
  Bottom 0.254: v22.58,42.33 22.53,42.28 v18.26,42.28 | v6.17,27.65 6.53,27.29 6.93,27.29 7.29,26.94 17.55,26.94 v17.91,27.29 | v76.84,15.25 72.06,15.25 v71.96,15.2 71.91,15.25 v62.97,15.25 62.92,15.15 62.66,14.9 57.79,14.9 57.43,15.25 v50.27,15.25 | v61.29,28.66 59.31,27.14 56.01,27.09 v52.45,25.06 | v35.69,8.55 35.99,8.85 40.61,8.85 v40.92,8.55 | v26.44,23.79 26.8,23.43 34.01,23.43 v34.37,23.79
5V  (via drill 0.41)
  Top 0.254: v73.74,14.44 73.74,16.62 SJ3.3 | v78.71,14.44 78.71,16.67 SJ1.3 78.71,16.78 v78.71,33.44 | XIO.2 96.55,51.47 96.49,51.52 94.01,51.52 XIO.1 94.01,49.9 92.74,48.63 92.74,33.95 v92.23,33.44 | C17.2 40.56,38.98 40.56,41.16 | 40.56,41.16 40.56,42.43 39.09,43.9 38.18,43.9 IC14.6 | 26.44,41.16 26.44,40.65 26.64,40.45 27.86,40.45 27.86,40.3 | 26.44,41.16 26.44,43.65 27.81,43.65 IC15.6 | 27.86,19.42 27.86,14.95 IC10.3 | 27.86,19.42 27.86,40.3 | 27.86,40.3 30.3,40.3 30.35,40.25 30.35,39.33 C16.2 31.17,39.38 v31.17,41.16 | 27.86,19.42 30.56,19.42 C64.A 30.66,19.42 31.52,19.42 31.83,19.11 v31.83,4.43 | D1.C 21.92,37.6 v21.92,41.26 | 26.44,41.16 v25.98,41.16 | v40.31,41.16 40.56,41.16 | v57.12,11.09 v57.12,14.44 | POWER.5 v38.13,10.99
  Bottom 0.254: v78.71,14.44 76.63,14.44 76.58,14.49 73.79,14.49 v73.74,14.44 73.63,14.39 71.65,14.39 71.25,14.8 63.63,14.8 63.27,14.44 v57.12,14.44 | v92.23,33.44 v78.71,33.44 | POWER.5 37.67,2.55 37.67,3.37 36.35,4.69 32.18,4.69 31.88,4.38 | 31.88,4.38 30.91,3.42 30.91,2.55 POWER.2 | v21.92,41.26 22.17,41.52 25.63,41.52 v25.98,41.16 | v40.31,41.16 39.95,41.52 31.52,41.52 v31.17,41.16 | v31.83,4.43 31.88,4.38 | v57.12,11.09 56.77,10.73 45.24,10.73 45.14,10.63 38.48,10.63 v38.13,10.99
5VREG  (via drill 0.41)
  Top 0.254: 8.66,13.78 4.39,13.78 4.34,13.83 4.29,13.78 IC2.4 | 8.66,13.78 IC2.2 | v17.7,13.63 PC2.+ | 8.66,13.78 v8.66,13.32
  Bottom 0.254: v17.7,13.63 17.4,13.32 v8.66,13.32
AGND
  Top 0.254: IC1.11 55.91,19.52 55.96,19.52 56.41,19.06 57.79,19.06 57.79,20.54 57.23,21.09 IC1.15
AVCC
  Top 0.254: C6.1 49.35,10.73 L1.1 49.35,11.29 49.4,11.34 51.33,11.34 51.33,16.67 54.58,19.93 54.89,19.93 | 54.89,19.93 54.89,20.23 55.3,20.64 55.45,20.64 56.11,19.98 IC1.12 | 54.89,19.93 54.89,19.77 55.35,19.32 55.4,19.32 IC1.10
BED0
  Top 0.254: JP6.10 41.68,48.63 41.88,48.63 R70.2
BEEPER  (via drill 0.41)
  Top 0.254: v60.83,20.18 60.83,20.99 59.06,22.77 59,22.77 IC1.20 | v65.86,18.55 v65.86,20.18 | v90.55,18.91 90.91,19.27 90.91,31.97 90.55,32.32 v90.55,34.25 | v95.07,34.25 95.12,34.3 96.55,34.3 XIO.14
  Bottom 0.254: v65.86,20.18 v60.83,20.18 | v65.86,18.55 66.22,18.2 80.04,18.2 80.39,18.55 82.78,18.55 83.13,18.91 v90.55,18.91 | v90.55,34.25 90.6,34.2 91.87,34.2 91.92,34.25 v95.07,34.25
E0-DIR  (via drill 0.41)
  Top 0.254: v47.07,36.08 46.36,35.37 47.93,33.79 47.98,33.79 IC1.56 | v54.69,38.42 v54.69,35.88 | v91.92,40.6 v91.92,38.77
  Bottom 0.254: v47.07,36.08 48.13,36.23 54.33,36.23 v54.69,35.88 | v54.69,38.42 55.04,38.06 58.85,38.06 59.21,38.42 89.08,38.42 89.43,38.77 v91.92,38.77 | v91.92,40.6 92.99,40.6 93.04,40.65 XIO.9
E0-EN  (via drill 0.41)
  Top 0.254: v90.6,37.15 v90.6,45.68 | v60.88,37.15 59.56,35.83 v59.56,33.29 | v51.23,32.78 49.3,31.76 48.39,32.73 47.78,33.34 47.73,33.34 47.68,33.39 IC1.57
  Bottom 0.254: XIO.5 93.04,45.73 92.99,45.68 v90.6,45.68 | v90.6,37.15 89.43,37.15 89.08,37.5 61.24,37.5 v60.88,37.15 | v59.56,33.29 59.21,32.93 v51.23,32.78
E0-STEP  (via drill 0.41)
  Top 0.254: v44.42,28 43.97,28 43.15,28.82 43.1,28.82 IC1.70 | v41.02,31.31 v41.02,28.92 | v43.1,31.31 43.46,31.66 43.46,40.14 v43.36,40.25 | v56.72,38.87 v56.72,41.26 | v89.79,43.14 v89.79,39.59
  Bottom 0.254: v44.42,28 43.51,28.92 v41.02,28.92 | v43.1,31.31 v41.02,31.31 | v43.36,40.25 47.63,40.25 48.44,41.06 56.52,41.06 v56.72,41.26 | v56.72,38.87 88.87,38.87 89.59,39.59 v89.79,39.59 | v89.79,43.14 92.99,43.14 93.04,43.19 XIO.7
E1-DIR  (via drill 0.41)
  Top 0.254: v53.01,37.96 53.01,36.28 52.3,35.57 IC1.50 | v89.74,37.96 89.74,33.95 90.09,33.59 v90.09,29.32
  Bottom 0.254: v53.01,37.96 53.37,37.6 59.06,37.6 59.41,37.96 v89.74,37.96 | v90.09,29.32 94.46,29.32 95.17,30.04 95.17,30.95 94.06,32.07 94.06,33.03 XIO.15
E1-STEP  (via drill 0.41)
  Top 0.254: v45.64,29.02 45.59,29.88 45.03,30.44 44.98,30.44 44.88,30.54 IC1.65 | v50.17,29.17 49.81,28.82 49.81,19.77 v50.17,19.42 | v76.73,19.01 77.04,19.32 v77.04,20.18 | v88.82,20.18 88.82,29.78 v88.47,30.14
  Bottom 0.254: v45.64,29.02 45.9,29.37 49.76,29.37 v50.17,29.17 | v50.17,19.42 50.22,19.37 58.29,19.37 58.39,19.47 59,19.47 59.36,19.11 64.03,19.11 64.39,19.47 65.46,19.47 65.56,19.37 66.17,19.37 66.88,18.66 76.38,18.66 v76.73,19.01 | v77.04,20.18 78.21,20.18 78.56,19.82 88.47,19.82 v88.82,20.18 | v88.47,30.14 90.4,30.14 90.75,29.78 92.53,29.78 93.14,30.39 93.24,30.39 93.35,30.49 XIO.17
ENCODER_A  (via drill 0.41)
  Top 0.254: v61.54,26.33 61.54,26.07 60.17,26.12 59.82,26.48 59.82,26.83 60.38,27.39 IC1.27 | v80.54,26.38 81.25,26.38 81.36,26.48 82.42,26.48 83.69,27.75 v83.69,31.76 | v92.74,31.76 96.55,31.76 XIO.18
  Bottom 0.254: v80.54,26.38 v61.54,26.33 | v92.74,31.76 v83.69,31.76
ENCODER_B  (via drill 0.41)
  Top 0.254: XIO.16 96.55,32.37 96.7,32.22 97.36,32.22 97.36,32.17 97.82,31.71 97.82,30.14 96.9,29.22 93.55,29.22 93.55,29.32 92.28,30.59 v92.28,30.64 | v62.2,29.43 62.1,29.32 62.1,28.36 61.54,27.8 61.49,27.8 60.78,27.09 IC1.26
  Bottom 0.254: v92.28,30.64 91.62,31.31 84.35,31.31 84,30.95 76.33,30.95 76.28,30.9 63.63,30.9 62.2,29.48 v62.2,29.43
ENCODER_CLICK  (via drill 0.41)
  Top 0.254: v57.94,25.72 58.5,25.87 58.5,23.94 59.21,23.23 59.26,23.23 59.31,23.18 IC1.21 | v77.9,25.56 78.26,25.21 78.26,19.72 v77.9,19.37 | v92.18,19.72 91.82,20.08 91.82,25.72 92.79,26.68 97,26.68 97,26.78 97.82,27.6 97.82,29.48 98.27,29.93 98.27,31.91 97.82,32.37 97.82,35.93 96.55,37.2 XIO.12
  Bottom 0.254: v57.94,25.72 58.45,26.12 60.38,26.12 61.24,25.36 61.85,25.36 62.36,25.82 77.5,25.82 v77.9,25.56 | v77.9,19.37 89.89,19.37 90.25,19.72 v92.18,19.72
FAN
  Top 0.254: JP6.9 39.14,48.58 39.19,48.58 R69.2
GND  (via drill 0.41, 0.5)  (2 unrouted)
  Top 0.254: IC1.72 42.38,28.12 43.92,26.58 | IC1.83 43.88,22.23 44.98,23.53 | IC1.97 48.72,17.16 47.57,16.01 47.57,15.86 | IC1.31 58.14,28 | IC1.55 v49.61,32.93
  Top 0.305: v54.84,30.8 54.84,31.76 55.4,32.32 IC1.41
  Top 0.406: 44.98,23.53 45.03,24.19 45.39,24.55 | 47.57,15.86 48.03,15.4 | 58.14,28 v57.84,27.8
  other vias: 43.97,26.28 45.59,24.7 48.03,15.51 83.59,42.53
  pour Top (isolate 0.305, rank 2): 0.66,52.72 101.63,52.72 101.63,0.65 0.66,0.65 0.66,29.86 0.66,46.37
  pour Bottom (isolate 0.305, rank 2): 0.66,52.72 101.63,52.72 102.26,52.08 102.26,0.65 1.3,0.65 0.66,1.28 0.66,29.86 0.66,46.37
HEATER
  Top 0.254: JP6.8 36.6,48.22 R4.2
ISP_BOOT  (via drill 0.41)
  Top 0.254: v81.92,30.14 JP25.3 | v77.8,30.14 72.72,30.14 S2.2 72.62,30.14 67.64,30.14 S2.1 67.54,30.14 66.73,30.14 v66.73,40.14 | v21.11,39.79 20.45,39.79 19.99,40.25 19.99,40.91 R15.1 | v48.29,39.79 48.29,35.57 48.95,34.91 49.05,34.91 49.05,34.86 IC1.53
  Bottom 0.254: v77.8,30.14 v81.92,30.14 | v21.11,39.79 27.36,39.79 27.71,39.43 44.07,39.43 44.42,39.79 v48.29,39.79 48.34,39.89 49.05,40.6 56.26,40.6 56.72,40.14 57.23,40.14 57.58,39.79 66.37,39.79 v66.73,40.14
LED1  (via drill 0.41)
  Top 0.254: v77.9,31.76 77.85,31.81 77.85,34.66 R10.2 | v82.52,31.76 82.88,31.41 v82.88,29.43 | v84.51,29.43 84.15,29.07 84.15,27.55 83.34,26.73 83.34,26.48 83.19,26.33 83.19,24.65 82.47,23.94 81.36,23.94 79.68,25.62 v79.68,27.19 | v56.41,26.38 55.5,28.05 58.19,28.71 IC1.32
  Bottom 0.254: v82.52,31.76 v77.9,31.76 | v84.51,29.43 v82.88,29.43 | v79.68,27.19 79.32,26.83 62.46,26.83 61.85,27.29 61.19,27.29 60.43,26.58 57.07,26.58 v56.41,26.38
LED2  (via drill 0.41)
  Top 0.254: v59.51,32.12 59.16,31.76 59.16,30.49 59,30.34 59,30.29 58.29,29.58 IC1.33 | v74.85,34.61 74.85,31.97 75.46,31.36 76.33,31.36 76.33,31.61 76.58,31.86 76.58,32.32 76.94,32.68 76.94,35.57 76.99,35.62 77.85,35.62 77.85,36.39 R11.2
  Bottom 0.254: v59.51,32.12 59.16,32.47 52.3,32.32 51.28,31.76 50.42,32.17 50.22,33.69 51.94,33.69 52.3,33.29 58.19,33.39 59.41,34.61 v74.85,34.61
LED3  (via drill 0.41)
  Top 0.254: v58.34,31.61 58.5,31.46 58.5,30.49 57.94,29.93 IC1.34 | v75.77,32.17 76.48,32.88 76.48,36.84 76.99,37.35 77.8,37.35 77.8,37.96 R12.2
  Bottom 0.254: v58.34,31.61 58.65,31.31 62.71,31.31 63.22,31.81 75.41,31.81 v75.77,32.17
LED4  (via drill 0.41)
  Top 0.254: v75.67,33.34 76.02,33.69 76.02,38.93 77.75,38.93 77.8,38.98 77.8,39.64 R13.2 | v55.09,28.92 56.82,29.48 57.53,30.19 IC1.35
  Bottom 0.254: v75.67,33.34 76.02,32.98 76.07,32.98 76.58,32.47 76.58,31.86 76.07,31.36 63.42,31.36 62.31,30.24 58.55,30.24 56.97,29.02 v55.09,28.92
MOSI1  (via drill 0.41)
  Top 0.254: v46.3,34.2 46.05,33.95 46.05,32.88 46.56,32.37 IC1.60 | v51.13,37.5 v51.08,34.45 | v59.72,37.15 59.36,37.5 59.36,44.97 v59.72,45.33 | COMMUNICATION.5 v76.23,44.97
  Bottom 0.254: v51.08,34.45 v46.3,34.2 | v51.13,37.5 51.49,37.15 v59.72,37.15 | v59.72,45.33 60.07,45.68 67.74,45.68 68.1,45.33 75.87,45.33 v76.23,44.97
N$1  (via drill 0.41)
  Top 0.254: C2.1 59.51,13.58 59.21,13.88 58.45,13.88 58.45,16.12 58.7,16.37 59.46,16.37 59.46,17.18 Q2.2 59.46,17.34 59.46,18.2 59.51,18.25 v59.51,20.99 | v60.93,22.62 60.63,22.62 59.77,23.48 59.72,23.48 IC1.22
  Bottom 0.254: v60.93,22.62 60.93,22.42 v59.51,20.99
N$2  (via drill 0.41)
  Top 0.254: C3.1 61.34,13.93 61.09,14.19 61.09,15 Q2.1 61.09,15.1 61.09,15.86 61.85,15.86 62.1,16.12 62.1,18.3 62.05,18.35 62.05,20.64 v61.7,20.99 | v59.31,25.31 59.31,24.55 59.92,23.94 59.97,23.94 60.02,23.89 IC1.23
  Bottom 0.254: v59.31,25.31 61.19,23.43 61.24,23.43 61.75,22.92 61.75,21.04 v61.7,20.99
N$4
  Top 0.254: R4.1 31.17,46.49 29.39,46.49 29.39,42.94 28.83,42.38 27.86,42.38 IC15.7
N$5
  Top 0.254: R69.1 39.19,46.85 36.65,46.85 36.65,43.19 37.21,42.63 38.13,42.63 IC14.7
N$19
  Top 0.254: R70.1 41.88,46.9 40.26,46.9 40.26,46.09 39.34,45.17 38.18,45.17 IC14.5
N$23
  Top 0.254: SJ1.2 77.8,13.58 78.36,13.02 JP5.3
N$51
  Top 0.254: Q1.3 20.9,44.06 20.85,44.11 20.85,44.26 19.69,44.26 R7.2
N$61  (via drill 0.41)
  Top 0.254: v11.71,41.72 11.91,41.72 13.64,43.45 13.64,44.11 R8.1
  Bottom 0.254: v11.71,41.72 11.66,41.67 10.08,41.67 X2.1
N$62  (via drill 0.41)
  Top 0.254: v11.71,44.26 12.32,44.26 13.84,45.78 13.84,46.65 R9.1
  Bottom 0.254: v11.71,44.26 11.66,44.21 10.08,44.21 X2.2
N$80
  Top 0.254: LED9.A 19.33,19.16 19.33,16.98 R77.1
N$84
  Top 0.254: LED4.A 80.39,39.69 80.34,39.74 80.34,39.89 79.53,39.89 79.53,39.64 R13.1
N$85
  Top 0.254: LED3.A 80.34,38.11 80.29,38.16 80.29,38.21 79.53,38.21 79.53,37.96 R12.1
N$86
  Top 0.254: LED2.A 80.29,36.49 80.24,36.54 80.24,36.64 79.58,36.64 79.58,36.39 R11.1
N$87
  Top 0.254: LED1.A 80.24,34.71 80.19,34.76 80.19,34.91 79.58,34.91 79.58,34.66 R10.1
N$124  (via drill 0.41)
  Top 0.254: 64.54,24.29 64.54,23.43 R5.2 | 64.54,24.29 64.54,25.67 R6.2 | SJ3.2 72.82,18.61 71.5,19.93 v71.5,23.53 | 64.54,24.29 v65.71,24.29
  Bottom 0.254: v71.5,23.53 70.74,24.29 v65.71,24.29
P1_23  (via drill 0.41)
  Top 0.254: IC15.2 33.1,42.38 34.06,42.38 34.11,42.33 35.18,42.33 R87.2 35.28,42.33 36.09,42.33 36.14,42.28 v36.14,37.76 | v53.52,29.83 55.85,29.93 56.82,30.9 IC1.37 | v41.83,29.98 41.83,37.35 v41.48,37.71
  Bottom 0.254: v53.52,29.83 52.71,29.83 v41.83,29.98 | v41.48,37.71 41.43,37.76 v36.14,37.76
P2.7
  Top 0.254: IC14.4 43.41,45.17 44.37,45.17 44.42,45.22 44.42,45.43 45.19,45.43 R72.2 45.19,45.07 45.19,44.11 46.05,43.24 46.05,41.92 45.95,41.82 45.95,41.72 43.92,39.69 43.92,30.75 44.42,30.24 IC1.66
P2.9  (via drill 0.41)
  Top 0.254: v27.05,38.98 25.17,40.86 25.17,43.09 24.1,43.09 Q1.1 | v44.73,38.98 44.37,38.62 44.37,31.71 45.19,30.9 IC1.64
  Bottom 0.254: v44.73,38.98 v27.05,38.98
PWM1  (via drill 0.41)
  Top 0.254: v46.91,41.26 46.91,42.58 R71.2 | IC14.2 43.36,42.63 42.44,42.63 41.83,42.02 41.83,41.67 v41.48,41.31 41.83,41.52 41.83,40.65 42.29,40.2 42.29,31 43.71,29.58 43.76,29.58 IC1.68
  Bottom 0.254: v46.91,41.26 46.86,41.31 v41.48,41.31
RESET  (via drill 0.41)
  Top 0.254: v64.69,18.66 64.69,21.15 R14.1 64.69,21.25 64.69,22.11 66.93,24.35 67.84,24.35 S1.1 67.95,24.35 72.92,24.35 S1.2 73.03,24.35 73.84,24.35 73.89,24.29 v73.89,22.67 | IC1.17 57.94,21.7 57.99,21.7 58.7,20.99 v58.7,18.66 58.6,18.61 58.45,18.45 58.45,16.78 57.99,16.32 v57.99,10.27 | v33.05,10.48 POWER.3
  Bottom 0.254: v64.69,18.66 v58.7,18.66 | v33.05,10.48 33.35,10.17 45.34,10.17 45.44,10.27 v57.99,10.27 | v73.89,22.67 JP25.1
RX_0  (via drill 0.41)
  Top 0.254: v50.83,17.28 50.27,17.28 49.45,16.47 IC1.99 | JP5.4 v80.9,17.28
  Bottom 0.254: v80.9,17.28 v50.83,17.28
SCK1  (via drill 0.41)
  Top 0.254: v47.57,31.15 47.57,31.05 46.56,31.05 46,31.61 45.95,31.61 IC1.62 | v45.14,37.2 45.24,37.2 45.75,37.96 45.75,38.87 48.13,41.36 v48.13,41.82 | v69.77,46.6 v69.77,42.07 | v95.02,47 96.55,47 XIO.4
  Bottom 0.254: v47.57,31.15 47.57,31.81 45.19,34.2 v45.14,37.2 | v48.13,41.82 48.44,41.52 55.85,41.52 56.41,42.07 v69.77,42.07 | v69.77,46.6 70.13,46.24 80.65,46.24 81.41,47 v95.02,47
SCL  (via drill 0.41)
  Top 0.254: 62.76,23.94 62.81,23.89 R5.1 | 62.76,23.94 61.8,23.94 61.44,23.58 61.09,23.58 60.43,24.24 IC1.24 | v64.64,28.56 64.24,28.16 64.24,27.9 63.78,27.44 63.78,26.38 63.68,26.28 63.68,25.06 63.42,24.8 63.42,24.7 63.17,24.7 62.81,24.35 62.81,24.04 62.76,23.94 | v79.93,32.63 v79.93,28.51 | v84.51,48.58 v84.51,32.63 | v91.36,32.63 v91.36,10.22
  Bottom 0.254: COMMUNICATION.1 85.93,50.81 85.93,50 84.61,48.68 84.51,48.68 | 84.51,48.68 20.5,48.68 19.23,49.95 19.23,50.81 JP6.1 | v64.64,28.56 65,28.92 77.34,28.92 77.39,28.87 79.58,28.87 v79.93,28.51 | v79.93,32.63 80.29,32.98 84.15,32.98 v84.51,32.63 84.3,32.98 91.01,32.98 v91.36,32.63 | v84.51,48.58 84.51,48.68 | XIO.33 93.04,10.17 92.99,10.22 v91.36,10.22
SD_CD  (via drill 0.41)
  Top 0.254: v49.45,39.79 48.74,39.08 48.74,35.83 49.2,35.37 49.25,35.37 49.4,35.22 IC1.52 | v88.57,39.69 88.93,39.33 88.93,37.66 89.28,37.3 89.28,24.96 v90.09,24.14 | v92.74,24.14 96.55,24.14 XIO.22
  Bottom 0.254: v49.45,39.79 49.81,40.14 56.06,40.14 56.52,39.69 57.02,39.69 57.38,39.33 88.21,39.33 v88.57,39.69 | v92.74,24.14 v90.09,24.14
SD_CS  (via drill 0.41)
  Top 0.254: v16.59,24.7 16.59,23.79 19.18,23.79 R1.1 19.28,23.74 v19.28,22.52 | v6.43,24.7 6.22,24.9 6.22,25.67 6.17,25.72 5.26,25.72 U1.2 | v37.41,22.52 41.38,22.52 42.34,23.48 IC1.79
  Bottom 0.254: v6.43,24.7 v16.59,24.7 | v19.28,22.52 v37.41,22.52
SD_MISO  (via drill 0.41)
  Top 0.254: 20.45,29.98 19.23,29.98 R2.1 | v20.45,30.85 20.45,29.98 | v6.38,30.85 6.02,31.2 4.85,31.2 U1.7 | 42.24,24.9 42.24,25.16 40.01,27.39 v39.5,27.39 | 42.24,24.9 42.24,24.8 41.68,24.24 IC1.77 | v20.55,27.85 20.55,29.93 20.45,29.98 | XIO.31 94.01,11.85 92.23,10.07 v92.23,9.41 | v70.74,13.53 v70.74,9.41 | v40.72,21.7 v40.72,13.53 | v42.34,25.87 42.44,25.01 42.34,24.9 42.24,24.9
  Bottom 0.254: v6.38,30.85 v20.45,30.85 | v39.5,27.39 36.96,27.39 36.91,27.44 36.3,27.44 35.94,27.09 21.31,27.09 v20.55,27.85 | v70.74,9.41 v92.23,9.41 | v70.74,13.53 70.38,13.88 64.03,13.88 63.68,13.53 57.99,13.53 57.63,13.17 43.21,13.17 42.85,12.81 41.43,12.81 v40.72,13.53 | v40.72,21.7 40.72,22.52 43.05,24.85 v42.34,25.87
SD_MOSI  (via drill 0.41)
  Top 0.254: v20.55,26.68 20.55,26.94 19.23,26.94 R3.1 | v6.63,26.48 6.43,26.48 6.12,26.78 4.85,26.78 U1.3 | IC1.76 41.28,24.6 39.24,26.63 v36.6,26.63 36.7,26.53 36.7,22.92 36.6,22.82 36.6,22.21 36.75,22.06 v36.75,7.73 | XIO.32 96.55,13.37 95.94,13.98 93.55,13.98 93.55,13.88 92.18,12.51 v92.18,11.14 | v46.91,9.46 46.71,9.26 v46.71,7.73
  Bottom 0.254: v6.63,26.48 20.35,26.48 v20.55,26.68 20.65,26.63 v36.6,26.63 | v92.18,11.14 92.08,11.04 91.06,11.04 89.89,9.87 71.4,9.87 70.64,10.63 59.46,10.63 58.29,9.46 57.68,9.46 57.33,9.82 47.27,9.82 v46.91,9.46 | v36.75,7.73 v46.71,7.73
SD_SCK  (via drill 0.41)
  Top 0.254: v6.27,29.68 6.27,29.02 4.85,29.02 U1.5 | v23.8,30.04 23.8,23.69 v24.16,23.33 | v40.41,23.33 40.77,22.97 41.17,22.97 41.28,23.08 41.28,23.13 41.99,23.84 IC1.78 | XIO.34 96.55,9.51 95.99,8.95 95.28,8.95 95.12,8.8 92.74,8.8 92.53,8.6 v91.36,8.6 | v68.86,8.6 68.5,8.95 v68.5,12.61 | v38.58,21.7 v38.58,12.1
  Bottom 0.254: v6.27,29.68 6.63,30.04 6.68,30.04 7.04,30.39 19.79,30.39 20.14,30.04 v23.8,30.04 | v24.16,23.33 24.51,22.97 36.75,22.97 37.11,23.33 38.58,23.33 | v40.41,23.33 38.58,23.33 | v91.36,8.6 91.01,8.95 71.4,8.95 71.04,8.6 v68.86,8.6 | v68.5,12.61 68.15,12.97 64.44,12.97 64.08,12.61 58.39,12.61 58.04,12.26 53.16,12.26 52.1,11.19 45.03,11.19 44.93,11.09 39.6,11.09 v38.58,12.1 | 38.58,23.33 v38.58,21.7
SDA  (via drill 0.41)
  Top 0.254: IC1.25 60.78,24.6 61.29,24.09 61.34,24.14 61.34,24.4 62.2,24.4 62.81,25.01 R6.1 62.81,25.77 62.81,27.14 63.78,28.1 v63.78,29.37 | v80.8,29.32 81.1,29.63 81.1,32.58 82.27,33.74 82.27,35.72 82.32,35.78 82.32,37.5 82.37,37.55 82.37,39.13 82.42,39.18 82.42,48.37 83.85,49.8 COMMUNICATION.2
  Bottom 0.254: v63.78,29.37 77.55,29.37 77.6,29.32 v80.8,29.32
SSEL1  (via drill 0.41)
  Top 0.254: v46.2,36.74 44.83,35.52 44.83,31.97 45.49,31.31 IC1.63 | v71.96,36.69 71.6,37.05 71.6,47.87 73.69,49.95 COMMUNICATION.6
  Bottom 0.254: v46.2,36.74 56.62,36.69 56.97,36.33 57.68,36.33 58.04,35.98 69.01,35.98 69.72,36.69 v71.96,36.69
TX_0  (via drill 0.41)
  Top 0.254: v50.11,18.25 50.11,17.84 49.1,16.83 IC1.98 | JP5.5 v83.44,18.1
  Bottom 0.254: v50.11,18.25 50.27,18.1 51.13,18.1 51.49,17.74 80.24,17.74 80.59,18.1 v83.44,18.1
USB_D+  (via drill 0.41)
  Top 0.254: 17.96,44.82 15.42,44.82 15.37,44.77 15.37,44.11 R8.2 | 17.96,44.82 17.96,44.01 R7.1 | IC1.29 59.72,28.16 60.48,28.92 60.48,30.64 C5.2 61.95,30.64 62,30.7 62,31.31 62.31,31.61 63.22,31.61 63.58,31.97 63.58,33.34 62.36,34.56 62.36,44.16 v62.71,44.51 | v18.06,47.1 18.06,44.87 17.96,44.82 | v54.74,47.41 56.36,45.78 56.36,44.61 v56.46,44.51
  Bottom 0.254: v18.06,47.1 18.42,47.46 20.4,47.46 20.7,47.76 54.38,47.76 v54.74,47.41 | v62.71,44.51 v56.46,44.51
USB_D-  (via drill 0.41)
  Top 0.254: v15.98,47.97 15.57,47.56 15.57,46.65 R9.2 | v61.9,47.87 61.9,32.88 61.95,32.83 | C4.2 61.95,32.83 | IC1.30 59.36,28.51 60.02,29.17 60.02,31.2 60.68,31.86 61.9,31.86 61.9,32.73 61.95,32.83
  Bottom 0.254: v15.98,47.97 16.03,47.92 20.19,47.92 20.5,48.22 61.54,48.22 v61.9,47.87
VIN  (via drill 0.41)
  Top 0.61: 12.52,15.2 11.61,16.12 10.54,16.12 IC2.3 | 12.52,15.2 13.28,14.44 13.28,13.78 C15.1 13.28,13.53 v13.28,12.46 | D2.C D2.A 12.17,7.68 12.32,7.84 12.32,15 12.52,15.2 | v45.75,9.46 POWER.8 | v26.24,9.51 25.68,10.07 24.77,10.07 PC1.+ 24.51,11.04 24.51,11.49 v23.34,12.66
  Bottom 0.61: v45.75,9.46 45.69,9.51 v26.24,9.51 | v13.28,12.46 13.49,12.66 v23.34,12.66
VUSB  (via drill 0.41)
  Top 0.254: D1.A 12.88,37.6 12.88,42.02 13.34,42.48 v13.79,42.48 | v11.4,42.89 11.35,42.89 11.3,42.94 9.37,42.94 8.86,43.45 8.05,43.45 8.05,44.16 X2.3
  Bottom 0.254: v13.79,42.48 13.39,42.89 v11.4,42.89
X-EN  (via drill 0.41)
  Top 0.254: v42.55,14.44 42.44,14.54 42.44,22.16 43.05,22.77 IC1.81 | v52.15,12.36 v52.15,14.44 | v69.62,13.07 69.93,13.37 69.93,20.23 v70.69,20.99 | v87.71,20.64 88.37,21.3 88.37,26.33 v88.01,26.68
  Bottom 0.254: v52.15,14.44 v42.55,14.44 | v52.15,12.36 52.5,12.71 57.84,12.71 58.19,13.07 63.88,13.07 64.24,13.42 69.27,13.42 v69.62,13.07 | v70.69,20.99 77.34,20.99 77.7,20.64 78.41,20.64 78.77,20.28 87.35,20.28 v87.71,20.64 | v88.01,26.68 94.36,26.68 95.63,27.95 XIO.20
X-MAX
  Top 0.254: PWML.3 58.45,33.95 IC1.39
X-MIN  (via drill 0.41)
  Top 0.254: IC1.38 57.23,32.02 57.23,32.07 58.9,33.74 58.9,47.05 v59.26,47.41 | PWML.4 v55.91,47.41
  Bottom 0.254: v55.91,47.41 v59.26,47.41
Y-MAX  (via drill 0.41)
  Top 0.254: v57.18,35.06 56.77,35.06 54.79,33.08 IC1.43 | COMMUNICATION.7 v71.15,35.42
  Bottom 0.254: v57.18,35.06 70.79,35.06 v71.15,35.42
Y-MIN  (via drill 0.41)
  Top 0.254: v57.63,46.6 57.99,46.24 57.99,34.2 55.91,32.12 55.91,32.07 55.85,32.02 55.8,32.02 IC1.40 | COMMUNICATION.8 v68.61,46.6
  Bottom 0.254: v68.61,46.6 v57.63,46.6
Z-DIR  (via drill 0.41)
  Top 0.254: v48.54,19.52 48.9,19.88 48.9,30.85 48.44,31.31 48.44,31.36 48.39,31.41 48.39,32.02 47.37,33.03 47.32,33.03 IC1.58 | v92.68,16.47 93.04,16.12 94.01,16.12 XIO.29
  Bottom 0.254: v48.54,19.52 48.54,18.45 50.52,16.47 51.13,16.47 51.49,16.83 80.24,16.83 80.59,16.47 v92.68,16.47
Z-MAX  (via drill 0.41)
  Top 0.254: v57.18,45.48 57.53,45.12 57.53,38.21 55.5,36.18 55.5,35.22 54.08,33.79 IC1.45 | COMMUNICATION.3 v81.31,45.78
  Bottom 0.254: v57.18,45.48 57.48,45.78 57.94,45.78 58.29,46.14 67.95,46.14 68.3,45.78 v81.31,45.78
Z-MIN  (via drill 0.41)
  Top 0.254: v56.31,35.88 56.31,35.32 54.43,33.44 IC1.44 | v70.03,35.88 70.69,36.54 70.69,47.51 v70.33,47.87 | COMMUNICATION.4 v78.77,47.87
  Bottom 0.254: v56.31,35.88 57.48,35.88 57.84,35.52 69.67,35.52 v70.03,35.88 | v70.33,47.87 70.69,48.22 78.41,48.22 v78.77,47.87
Z-STEP  (via drill 0.41)
  Top 0.254: v90.55,15.66 v90.55,17.74 | v79.78,16.01 79.68,15.91 v79.68,13.73 | v41.53,15.1 41.99,15.56 41.99,20.59 v41.63,20.94 | v44.22,24.85 43.1,25.62 42.8,26.89 42.04,27.7 42.04,27.75 IC1.73
  Bottom 0.254: XIO.27 93.04,17.79 92.99,17.74 v90.55,17.74 | v90.55,15.66 90.2,16.01 v79.78,16.01 | v79.68,13.73 79.12,13.73 79.02,13.63 78.41,13.63 78.05,13.98 76.43,13.98 76.38,14.03 74.45,14.03 74.04,13.63 73.43,13.63 73.13,13.93 71.45,13.93 71.04,14.34 63.83,14.34 63.47,13.98 57.79,13.98 57.43,13.63 42.24,13.63 41.53,14.34 v41.53,15.1 | v41.63,20.94 41.63,21.86 v44.22,24.85

### Text on the board
tPlace: 8 | 7 | 6 | 5 | 4 | 3 | 2 | 0 | 22 | 14 | 15 | 16 | 17 | 18 | 19 | 20 | 21 | 24 | 26 | 28 | 30 | 31 | 32 | 33 | 34 | 35 | 36 | 37 | 38 | 39 | 40 | 41 | 42 | 43 | 44 | 45 | 46 | 47 | 48 | 49 | 50 | 51 | 52 | 53 | 0 | 1 | 2 | 3 | 4 | 5 | 6 | 7 | 8 | 9 | 10 | 11 | 12 | 13 | 14 | 15
tNames: 5V | TX3 | RX3 | TX2 | RX2 | TX1 | RX1 | SDA | SCL | 1 | GND | IOREF | RESET | 3V3 | 5V | GND | VIN